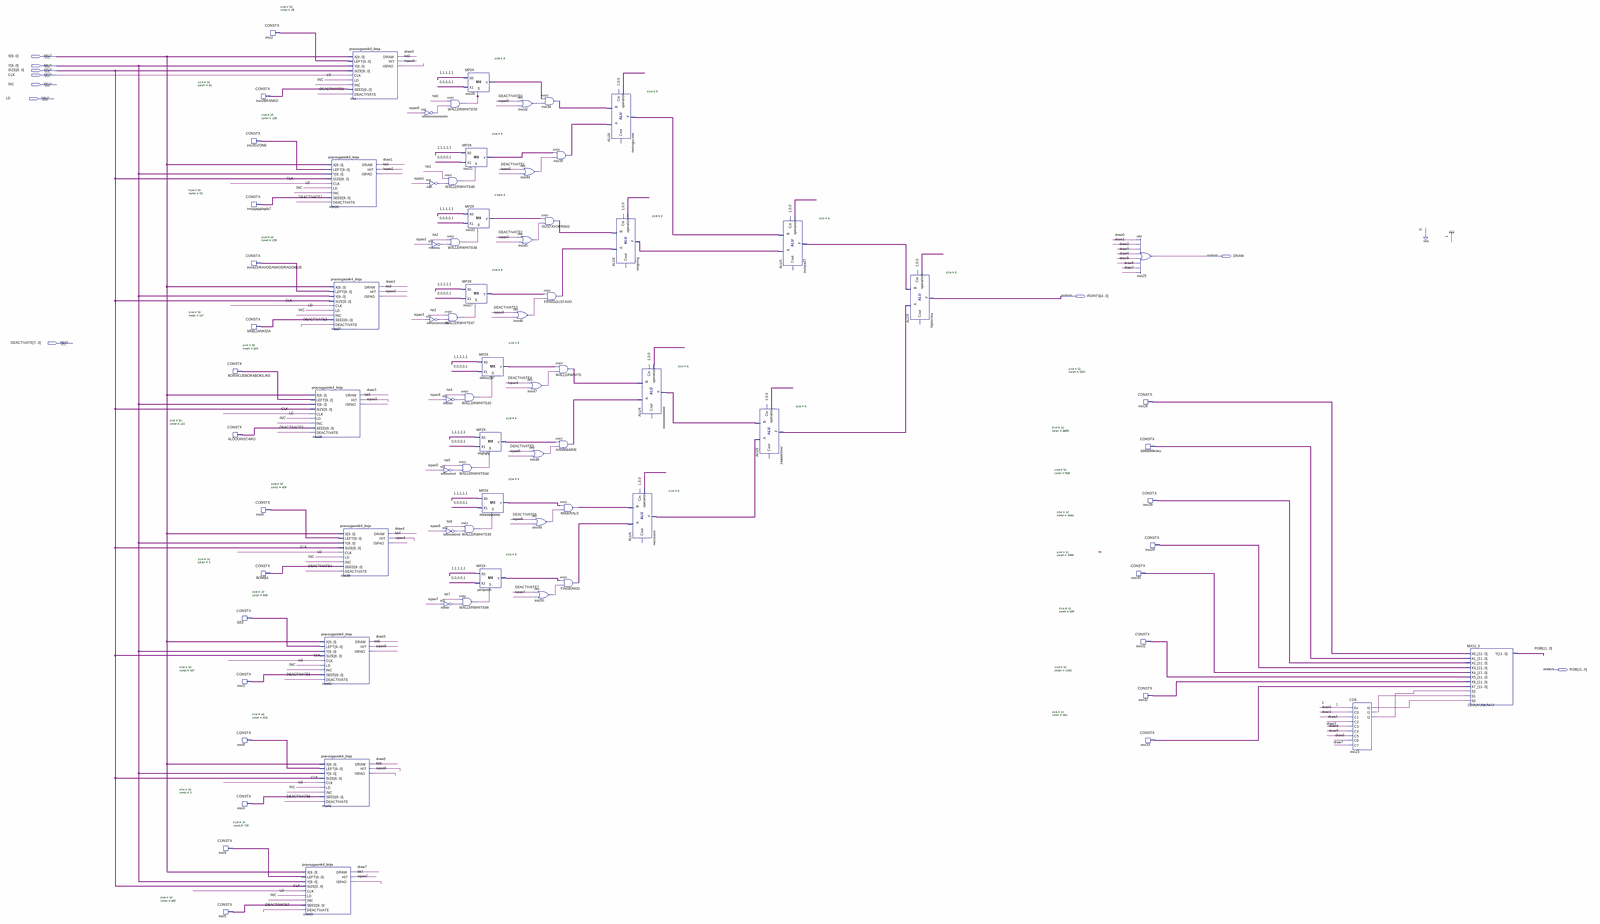
[diagram p0: schematic sheet, whole]
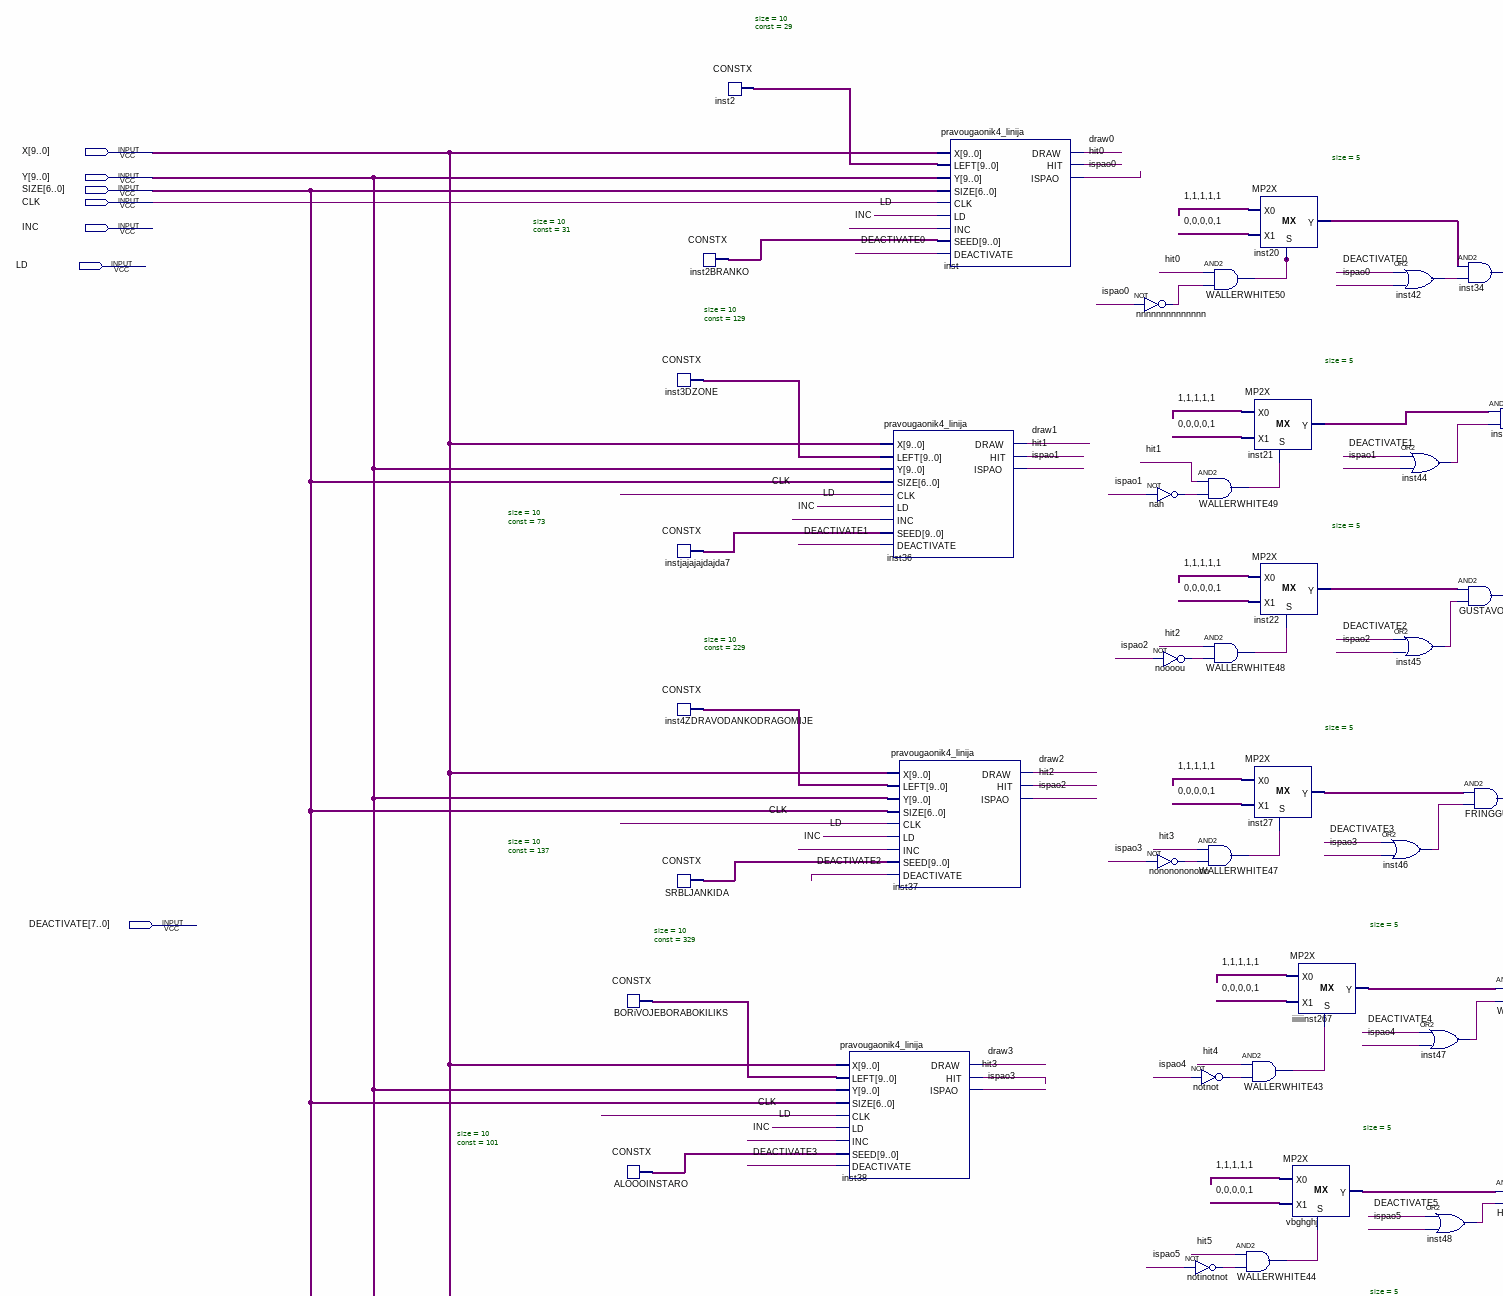
[diagram p1: schematic sheet, upper left part]
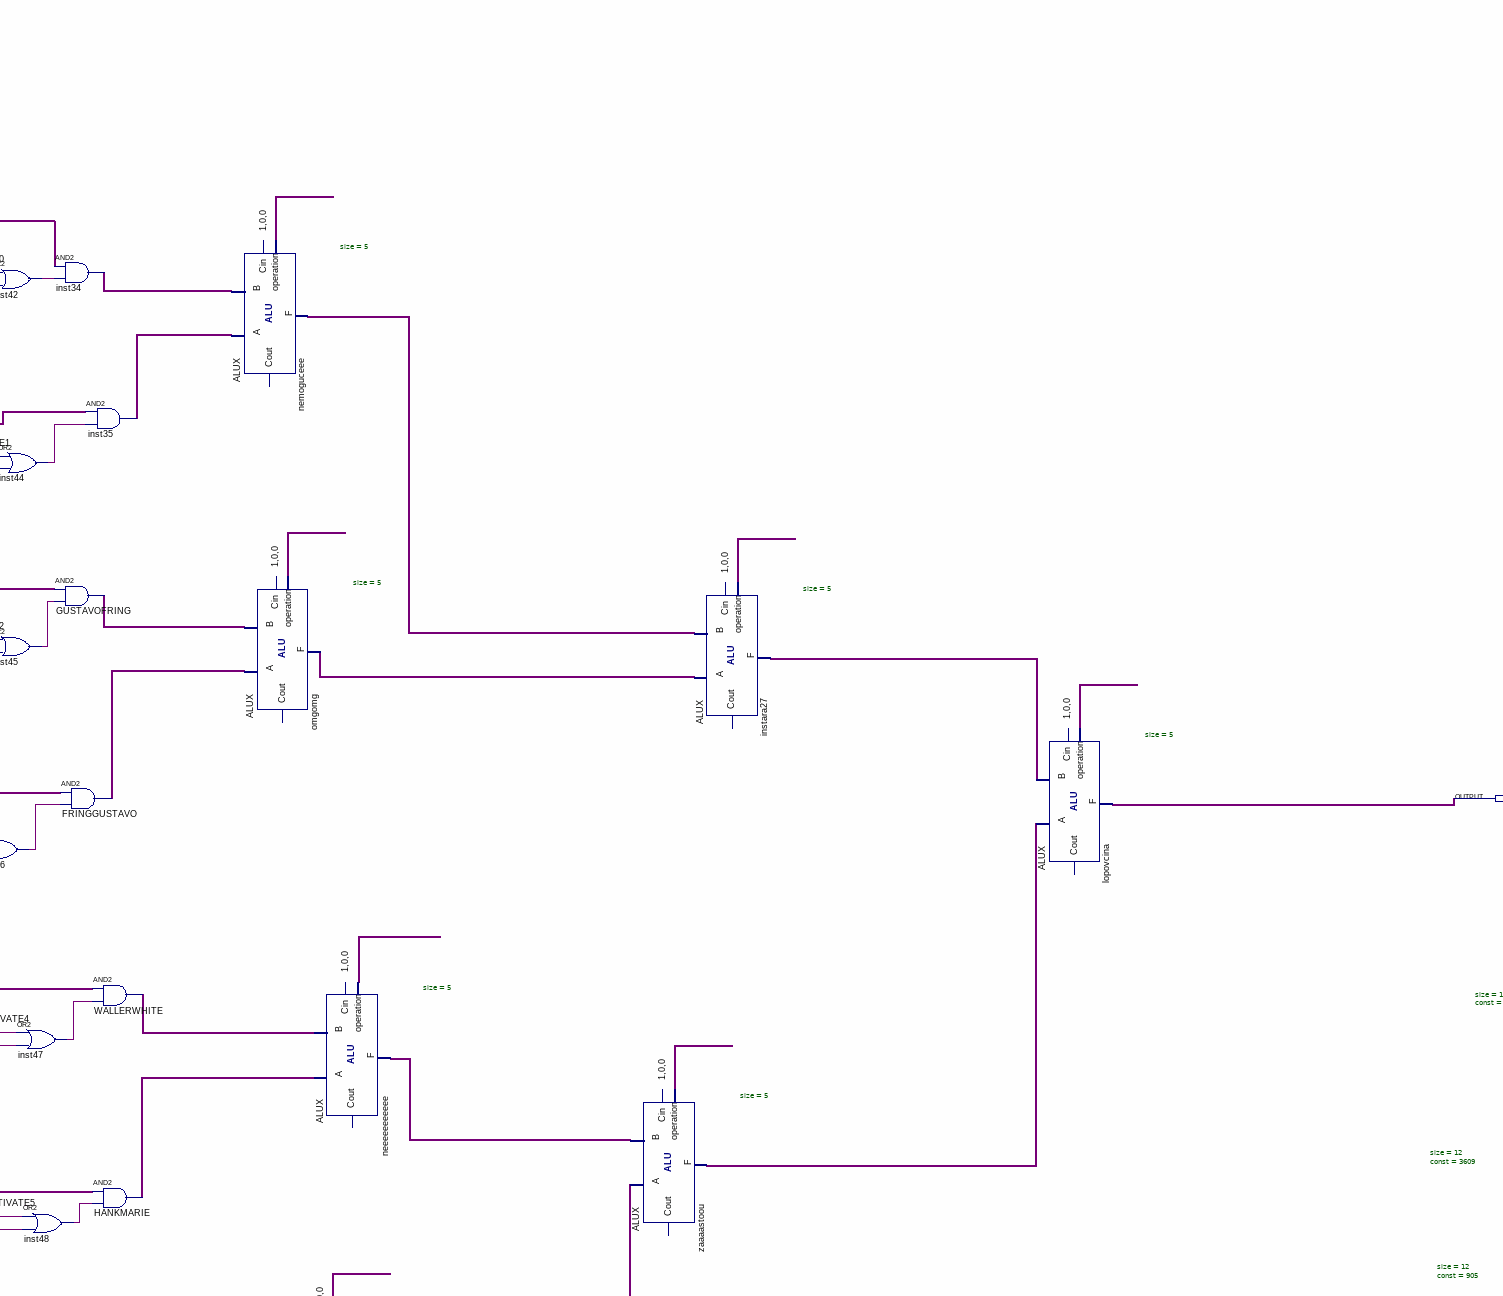
[diagram p2: schematic sheet, upper centre part]
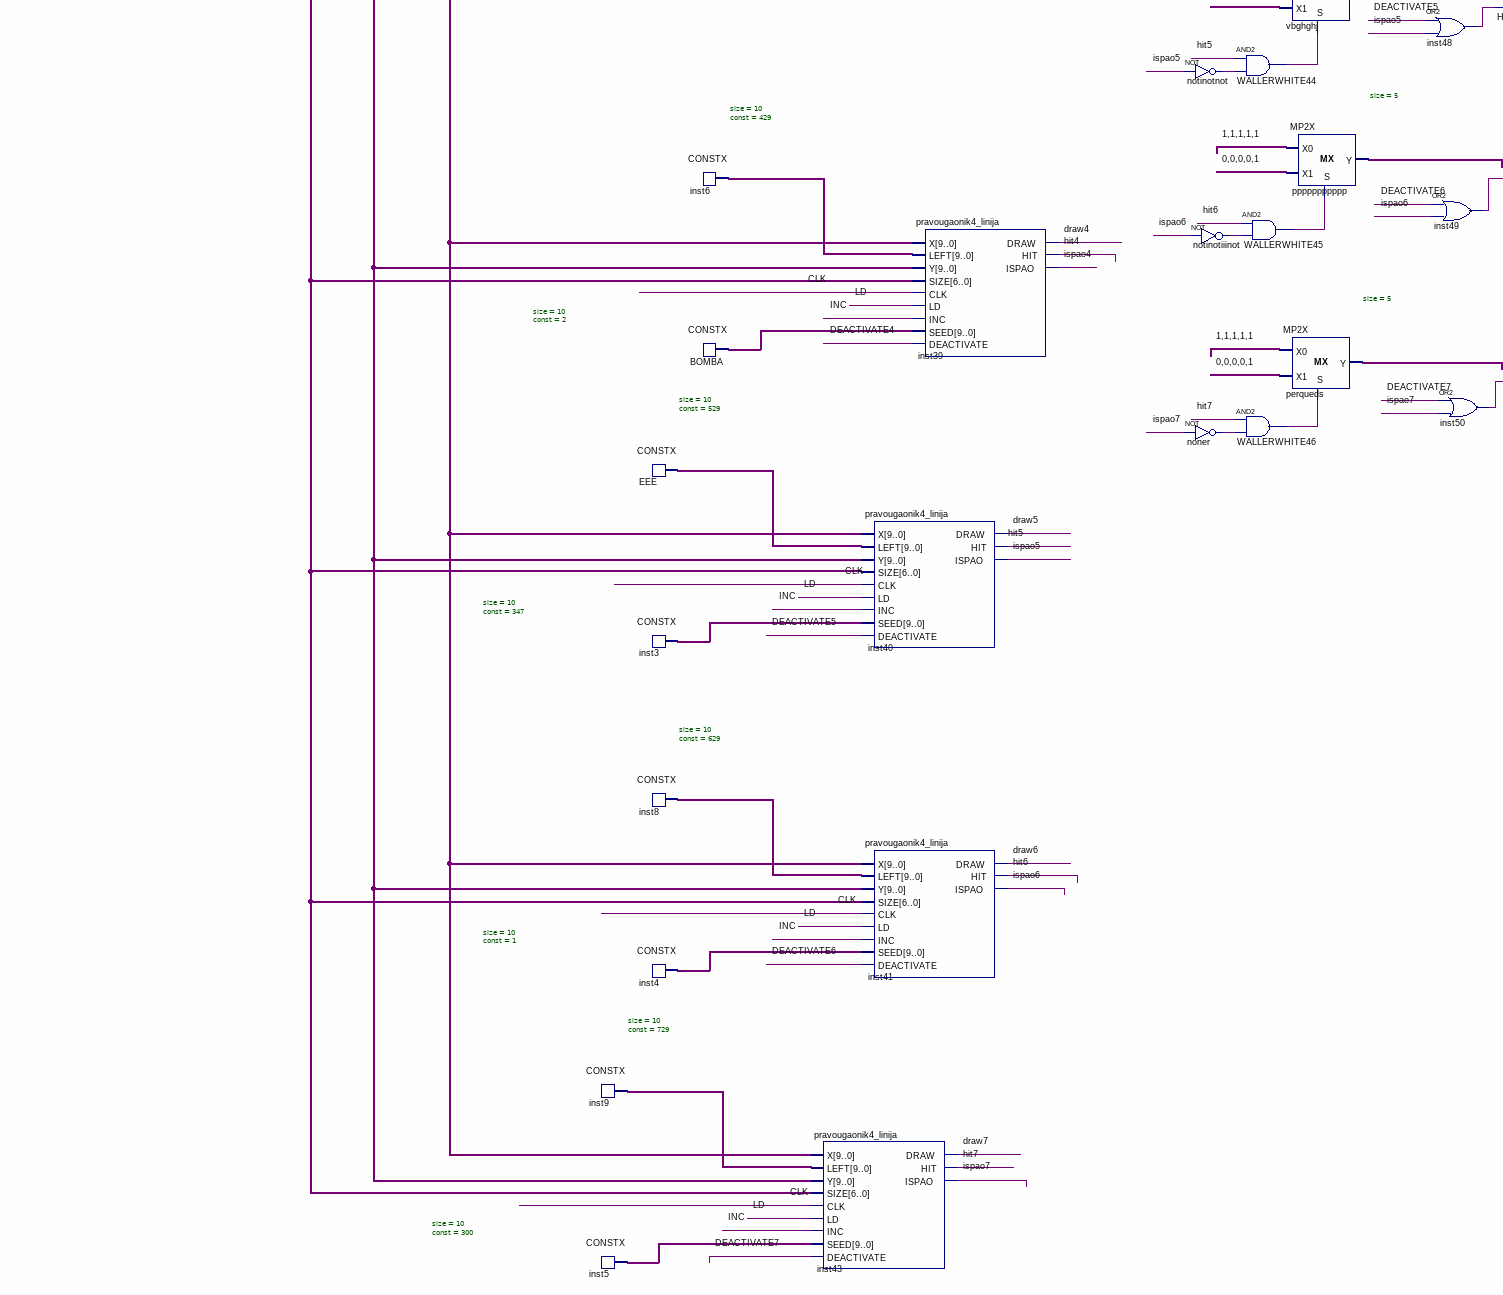
[diagram p3: schematic sheet, lower left part]
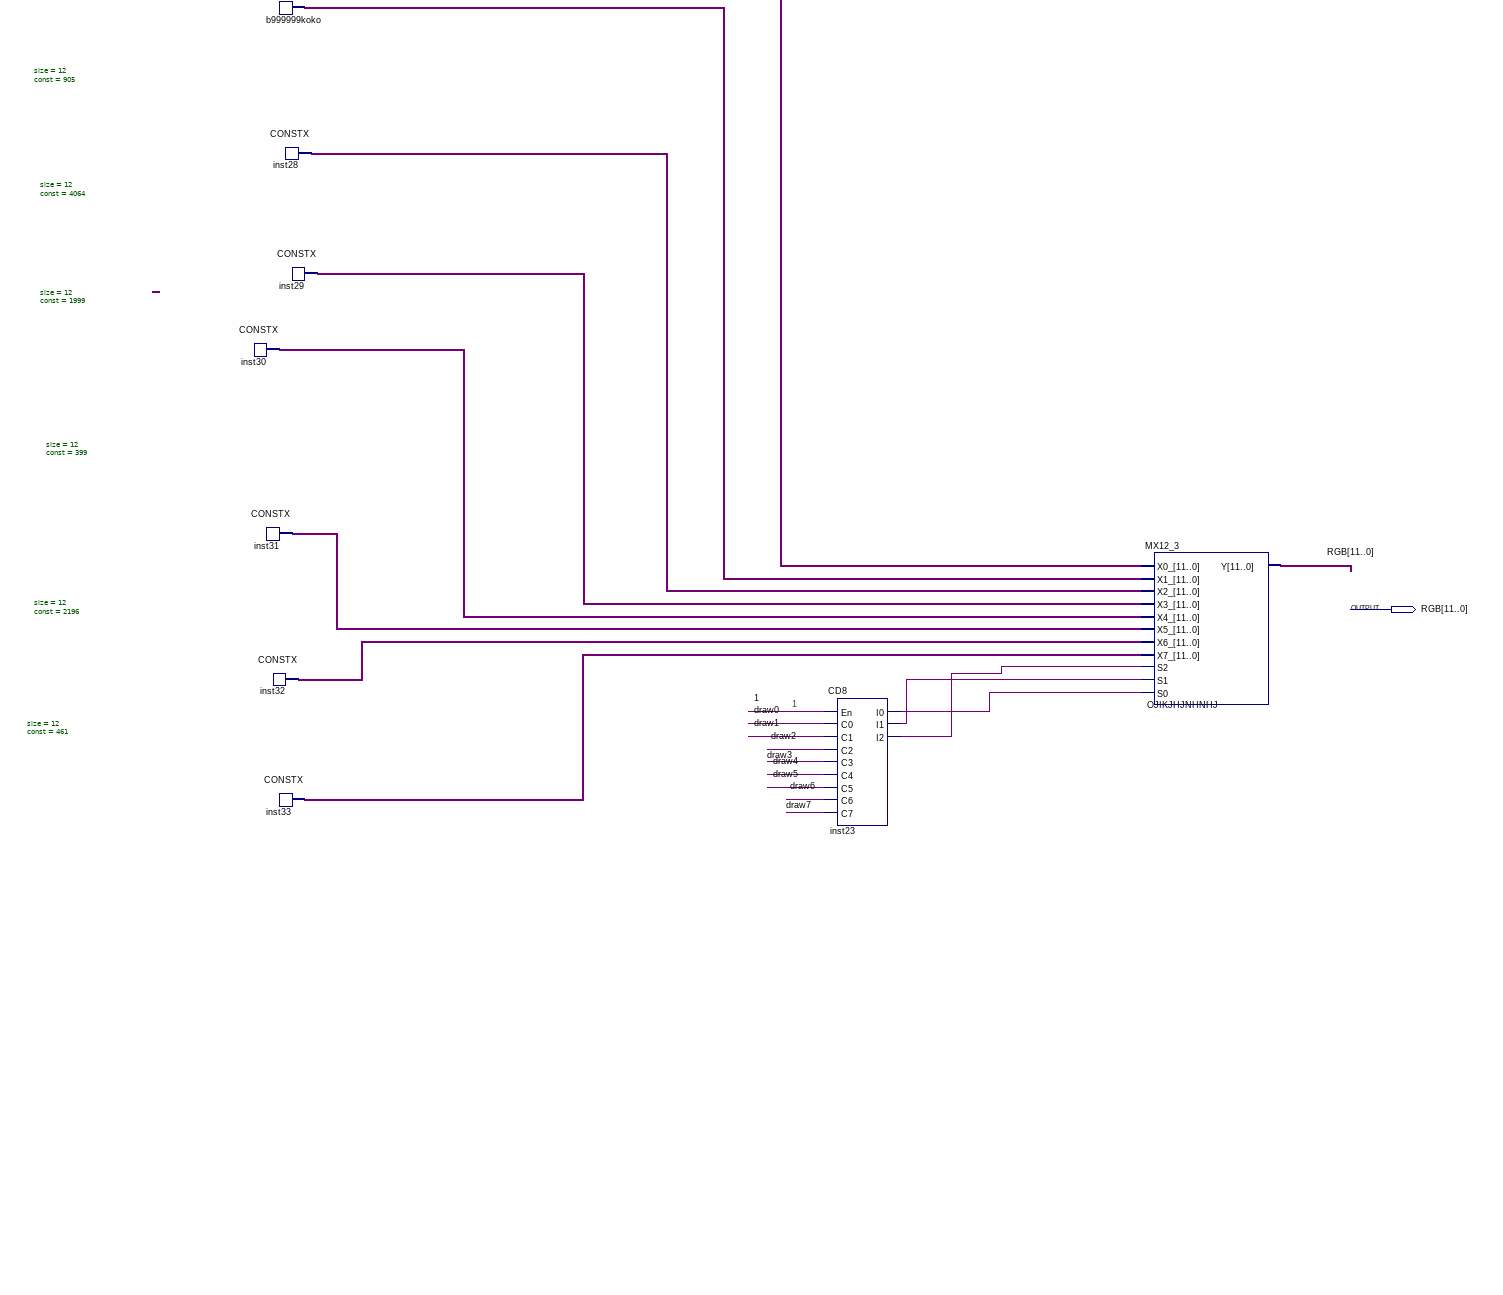
[diagram p4: schematic sheet, lower right part]
// Quartus schematic pravougaonik32_sve.bdf as structural Verilog: 82 symbols, 10 pins
module pravougaonik32_sve (
  input  [9:0] X,
  input  [9:0] Y,
  input  [6:0] SIZE,
  input  CLK,
  input  INC,
  input  LD,
  input  [7:0] DEACTIVATE,
  output DRAW,
  output [4:0] POINTS,
  output [11:0] RGB
);

  wire draw0, draw1, draw2, draw3, draw4, draw5, draw6, draw7, hit0, hit1, hit2, hit3, hit4, hit5, hit6,
       hit7, inst23_i0, inst23_i1, inst23_i2, inst42_out, inst44_out, inst45_out, inst46_out, inst47_out,
       inst48_out, inst49_out, inst50_out, ispao0, ispao1, ispao2, ispao3, ispao4, ispao5, ispao6, ispao7,
       nah_out, nnnnnnnnnnnnnn_out, noner_out, nononononono_out, noooou_out, notinotiiinot_out,
       notinotnot_out, notnot_out, WALLERWHITE43_out, WALLERWHITE44_out, WALLERWHITE45_out,
       WALLERWHITE46_out, WALLERWHITE47_out, WALLERWHITE48_out, WALLERWHITE49_out, WALLERWHITE50_out;
  wire [4:0] FINGERKID_out, FRINGGUSTAVO_out, GUSTAVOFRING_out, HANKMARIE_out, iiiiiinst267_y, inst20_y,
       inst21_y, inst22_y, inst27_y, inst34_out, inst35_out, instara27_f, MINERALS_out, neeeeeeeeeee_f,
       nemoguceee_f, nezovese_f, omgomg_f, perqueds_y, ppppppppppp_y, vbghghj_y, WALLERWHITE_out,
       zaaaastoou_f;
  wire [9:0] ALOOOINSTARO_data, BOMBA_data, BORiVOJEBORABOKILIKS_data, EEE_data, inst2_data,
       inst2BRANKO_data, inst3_data, inst3DZONE_data, inst4_data, inst4ZDRAVODANKODRAGOMIJE_data, inst5_data,
       inst6_data, inst8_data, inst9_data, instjajajajdajda7_data, SRBLJANKIDA_data;
  wire [11:0] b999999koko_data, inst26_data, inst28_data, inst29_data, inst30_data, inst31_data, inst32_data,
       inst33_data;

  CONSTX #(.size(10), .\const (729)) inst9 (.data(inst9_data));
  CONSTX #(.size(10), .\const (300)) inst5 (.data(inst5_data));
  CONSTX #(.size(10), .\const (329)) BORiVOJEBORABOKILIKS (.data(BORiVOJEBORABOKILIKS_data));
  CONSTX #(.size(10), .\const (101)) ALOOOINSTARO (.data(ALOOOINSTARO_data));
  CONSTX #(.size(10), .\const (529)) EEE (.data(EEE_data));
  CONSTX #(.size(10), .\const (347)) inst3 (.data(inst3_data));
  CONSTX #(.size(10), .\const (629)) inst8 (.data(inst8_data));
  CONSTX #(.size(10), .\const (1)) inst4 (.data(inst4_data));
  CONSTX #(.size(10), .\const (31)) inst2BRANKO (.data(inst2BRANKO_data));
  CONSTX #(.size(10), .\const (129)) inst3DZONE (.data(inst3DZONE_data));
  CONSTX #(.size(10), .\const (73)) instjajajajdajda7 (.data(instjajajajdajda7_data));
  CONSTX #(.size(10), .\const (229)) inst4ZDRAVODANKODRAGOMIJE (.data(inst4ZDRAVODANKODRAGOMIJE_data));
  CONSTX #(.size(10), .\const (137)) SRBLJANKIDA (.data(SRBLJANKIDA_data));
  CONSTX #(.size(10), .\const (429)) inst6 (.data(inst6_data));
  CONSTX #(.size(10), .\const (2)) BOMBA (.data(BOMBA_data));
  CONSTX #(.size(10), .\const (29)) inst2 (.data(inst2_data));
  pravougaonik4_linija inst38 (
    .X(X), .LEFT(BORiVOJEBORABOKILIKS_data), .Y(Y), .SIZE(SIZE), .CLK(CLK), .LD(LD), .INC(INC),
    .SEED(ALOOOINSTARO_data), .DEACTIVATE(DEACTIVATE[3]), .DRAW(draw3), .HIT(hit3), .ISPAO(ispao3));
  pravougaonik4_linija inst43 (
    .X(X), .LEFT(inst9_data), .Y(Y), .SIZE(SIZE), .CLK(CLK), .LD(LD), .INC(INC), .SEED(inst5_data),
    .DEACTIVATE(DEACTIVATE[7]), .DRAW(draw7), .HIT(hit7), .ISPAO(ispao7));
  pravougaonik4_linija inst36 (
    .X(X), .LEFT(inst3DZONE_data), .Y(Y), .SIZE(SIZE), .CLK(CLK), .LD(LD), .INC(INC),
    .SEED(instjajajajdajda7_data), .DEACTIVATE(DEACTIVATE[1]), .DRAW(draw1), .HIT(hit1), .ISPAO(ispao1));
  pravougaonik4_linija inst37 (
    .X(X), .LEFT(inst4ZDRAVODANKODRAGOMIJE_data), .Y(Y), .SIZE(SIZE), .CLK(CLK), .LD(LD), .INC(INC),
    .SEED(SRBLJANKIDA_data), .DEACTIVATE(DEACTIVATE[2]), .DRAW(draw2), .HIT(hit2), .ISPAO(ispao2));
  pravougaonik4_linija inst40 (
    .X(X), .LEFT(EEE_data), .Y(Y), .SIZE(SIZE), .CLK(CLK), .LD(LD), .INC(INC), .SEED(inst3_data),
    .DEACTIVATE(DEACTIVATE[5]), .DRAW(draw5), .HIT(hit5), .ISPAO(ispao5));
  pravougaonik4_linija inst41 (
    .X(X), .LEFT(inst8_data), .Y(Y), .SIZE(SIZE), .CLK(CLK), .LD(LD), .INC(INC), .SEED(inst4_data),
    .DEACTIVATE(DEACTIVATE[6]), .DRAW(draw6), .HIT(hit6), .ISPAO(ispao6));
  pravougaonik4_linija inst (
    .X(X), .LEFT(inst2_data), .Y(Y), .SIZE(SIZE), .CLK(CLK), .LD(LD), .INC(INC), .SEED(inst2BRANKO_data),
    .DEACTIVATE(DEACTIVATE[0]), .DRAW(draw0), .HIT(hit0), .ISPAO(ispao0));
  pravougaonik4_linija inst39 (
    .X(X), .LEFT(inst6_data), .Y(Y), .SIZE(SIZE), .CLK(CLK), .LD(LD), .INC(INC), .SEED(BOMBA_data),
    .DEACTIVATE(DEACTIVATE[4]), .DRAW(draw4), .HIT(hit4), .ISPAO(ispao4));
  not nnnnnnnnnnnnnn (nnnnnnnnnnnnnn_out, ispao0);
  not nah (nah_out, ispao1);
  not noooou (noooou_out, ispao2);
  not nononononono (nononononono_out, ispao3);
  and WALLERWHITE50 (WALLERWHITE50_out, hit0, nnnnnnnnnnnnnn_out);
  and WALLERWHITE49 (WALLERWHITE49_out, hit1, nah_out);
  and WALLERWHITE48 (WALLERWHITE48_out, hit2, noooou_out);
  and WALLERWHITE47 (WALLERWHITE47_out, hit3, nononononono_out);
  not notnot (notnot_out, ispao4);
  not notinotnot (notinotnot_out, ispao5);
  not notinotiiinot (notinotiiinot_out, ispao6);
  not noner (noner_out, ispao7);
  MP2X #(.size(5)) inst20 (.S(WALLERWHITE50_out), .X0({5{1'b1}}), .X1(5'b00001), .Y(inst20_y));
  MP2X #(.size(5)) inst21 (.S(WALLERWHITE49_out), .X0({5{1'b1}}), .X1(5'b00001), .Y(inst21_y));
  MP2X #(.size(5)) inst22 (.S(WALLERWHITE48_out), .X0({5{1'b1}}), .X1(5'b00001), .Y(inst22_y));
  MP2X #(.size(5)) inst27 (.S(WALLERWHITE47_out), .X0({5{1'b1}}), .X1(5'b00001), .Y(inst27_y));
  and WALLERWHITE43 (WALLERWHITE43_out, hit4, notnot_out);
  and WALLERWHITE44 (WALLERWHITE44_out, hit5, notinotnot_out);
  and WALLERWHITE45 (WALLERWHITE45_out, hit6, notinotiiinot_out);
  and WALLERWHITE46 (WALLERWHITE46_out, hit7, noner_out);
  MP2X #(.size(5)) iiiiiinst267 (.S(WALLERWHITE43_out), .X0({5{1'b1}}), .X1(5'b00001), .Y(iiiiiinst267_y));
  MP2X #(.size(5)) vbghghj (.S(WALLERWHITE44_out), .X0({5{1'b1}}), .X1(5'b00001), .Y(vbghghj_y));
  MP2X #(.size(5)) ppppppppppp (.S(WALLERWHITE45_out), .X0({5{1'b1}}), .X1(5'b00001), .Y(ppppppppppp_y));
  MP2X #(.size(5)) perqueds (.S(WALLERWHITE46_out), .X0({5{1'b1}}), .X1(5'b00001), .Y(perqueds_y));
  or inst42 (inst42_out, DEACTIVATE[0], ispao0);
  or inst44 (inst44_out, DEACTIVATE[1], ispao1);
  or inst45 (inst45_out, DEACTIVATE[2], ispao2);
  or inst46 (inst46_out, DEACTIVATE[3], ispao3);
  assign inst34_out = inst20_y & {5{inst42_out}};  // AND2 inst34, 5 bits wide
  assign GUSTAVOFRING_out = inst22_y & {5{inst45_out}};  // AND2 GUSTAVOFRING, 5 bits wide
  or inst47 (inst47_out, DEACTIVATE[4], ispao4);
  or inst48 (inst48_out, DEACTIVATE[5], ispao5);
  or inst49 (inst49_out, DEACTIVATE[6], ispao6);
  or inst50 (inst50_out, DEACTIVATE[7], ispao7);
  assign inst35_out = inst21_y & {5{inst44_out}};  // AND2 inst35, 5 bits wide
  assign FRINGGUSTAVO_out = inst27_y & {5{inst46_out}};  // AND2 FRINGGUSTAVO, 5 bits wide
  assign WALLERWHITE_out = iiiiiinst267_y & {5{inst47_out}};  // AND2 WALLERWHITE, 5 bits wide
  assign HANKMARIE_out = vbghghj_y & {5{inst48_out}};  // AND2 HANKMARIE, 5 bits wide
  assign MINERALS_out = ppppppppppp_y & {5{inst49_out}};  // AND2 MINERALS, 5 bits wide
  assign FINGERKID_out = perqueds_y & {5{inst50_out}};  // AND2 FINGERKID, 5 bits wide
  ALUX #(.size(5)) nemoguceee (.B(inst34_out), .A(inst35_out), .op(3'b100), .F(nemoguceee_f));  // open: Cin, Cout
  ALUX #(.size(5)) omgomg (.B(GUSTAVOFRING_out), .A(FRINGGUSTAVO_out), .op(3'b100), .F(omgomg_f));  // open: Cin, Cout
  ALUX #(.size(5)) nezovese (.B(MINERALS_out), .A(FINGERKID_out), .op(3'b100), .F(nezovese_f));  // open: Cin, Cout
  ALUX #(.size(5)) neeeeeeeeeee (
    .B(WALLERWHITE_out), .A(HANKMARIE_out), .op(3'b100), .F(neeeeeeeeeee_f));  // open: Cin, Cout
  ALUX #(.size(5)) zaaaastoou (.B(neeeeeeeeeee_f), .A(nezovese_f), .op(3'b100), .F(zaaaastoou_f));  // open: Cin, Cout
  ALUX #(.size(5)) instara27 (.B(nemoguceee_f), .A(omgomg_f), .op(3'b100), .F(instara27_f));  // open: Cin, Cout
  ALUX #(.size(5)) lopovcina (.B(instara27_f), .A(zaaaastoou_f), .op(3'b100), .F(POINTS));  // open: Cin, Cout
  or inst25 (DRAW, draw0, draw1, draw2, draw3, draw4, draw5, draw6, draw7);
  CONSTX #(.size(12), .\const (1522)) inst26 (.data(inst26_data));
  CONSTX #(.size(12), .\const (3609)) b999999koko (.data(b999999koko_data));
  CONSTX #(.size(12), .\const (905)) inst28 (.data(inst28_data));
  CONSTX #(.size(12), .\const (4064)) inst29 (.data(inst29_data));
  CONSTX #(.size(12), .\const (1999)) inst30 (.data(inst30_data));
  CONSTX #(.size(12), .\const (399)) inst31 (.data(inst31_data));
  CONSTX #(.size(12), .\const (2196)) inst32 (.data(inst32_data));
  CONSTX #(.size(12), .\const (461)) inst33 (.data(inst33_data));
  CD8 inst23 (
    .En(1'b1), .C0(draw0), .C1(draw1), .C2(draw2), .C3(draw3), .C4(draw4), .C5(draw5), .C6(draw6),
    .C7(draw7), .I0(inst23_i0), .I1(inst23_i1), .I2(inst23_i2));
  MX12_3 OJIKJHJNHNHJ (
    .X0_(inst26_data), .X1_(b999999koko_data), .X2_(inst28_data), .X3_(inst29_data), .X4_(inst30_data),
    .X5_(inst31_data), .X6_(inst32_data), .X7_(inst33_data), .S2(inst23_i2), .S1(inst23_i1), .S0(inst23_i0),
    .Y(RGB));

  // Notes on the sheet:
  //   1
endmodule
